# Altium project DC309A.PrjPcb (part 3 of 7)

## Sheet DC309A_PowerSupplies.SchDoc: PowerSupplies
size 558 x 431 mm; Date: Not shown in title block; ApprovedBy: Not shown in title block; CheckedBy: Not shown in title block; Author: Not shown in title block; CompanyName: Not shown in title block; DrawnBy: KAVIKANNAN; Engineer: Not shown in title block; Organization: Not shown in title block; Address1: Not shown in title block; Address2: Not shown in title block; Address3: Not shown in title block; Address4: Not shown in title block; DocumentNumber: 5; Revision: Use project parameter SCH_Rev; SheetNumber: 5; SheetTotal: 11; PageSetup: Record=PageOptions|CenterHorizontal=True|CenterVertical=True|PrintScale=1.00|XCorrection=1.00|YCorrection=1.00|PrintKind=0|BorderSize=5000000|LeftOffset=0|BottomOffset=0|Orientation=2|PaperLength=1000|PaperWidth=1000|Scale=100|PaperSource=15|PrintQuality=600|MediaType=1|DitherType=10|PaperKind=Letter|PrintScaleMode=1; CurrentTime: Not shown in title block; CurrentDate: Not shown in title block; Time: Not shown in title block; DocumentFullPathAndName: Not shown in title block; DocumentName: Not shown in title block; ModifiedDate: Not shown in title block; ImagePath: Not shown in title block
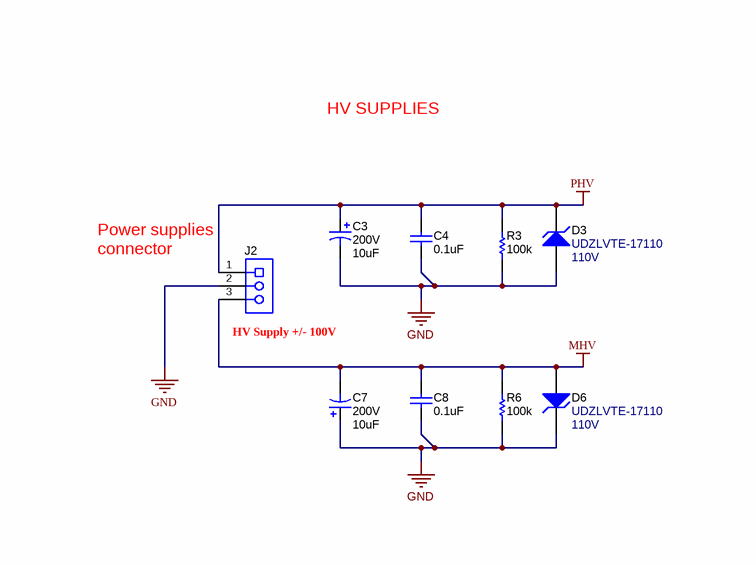
[diagram p12: DC309A_PowerSupplies.SchDoc, top left]
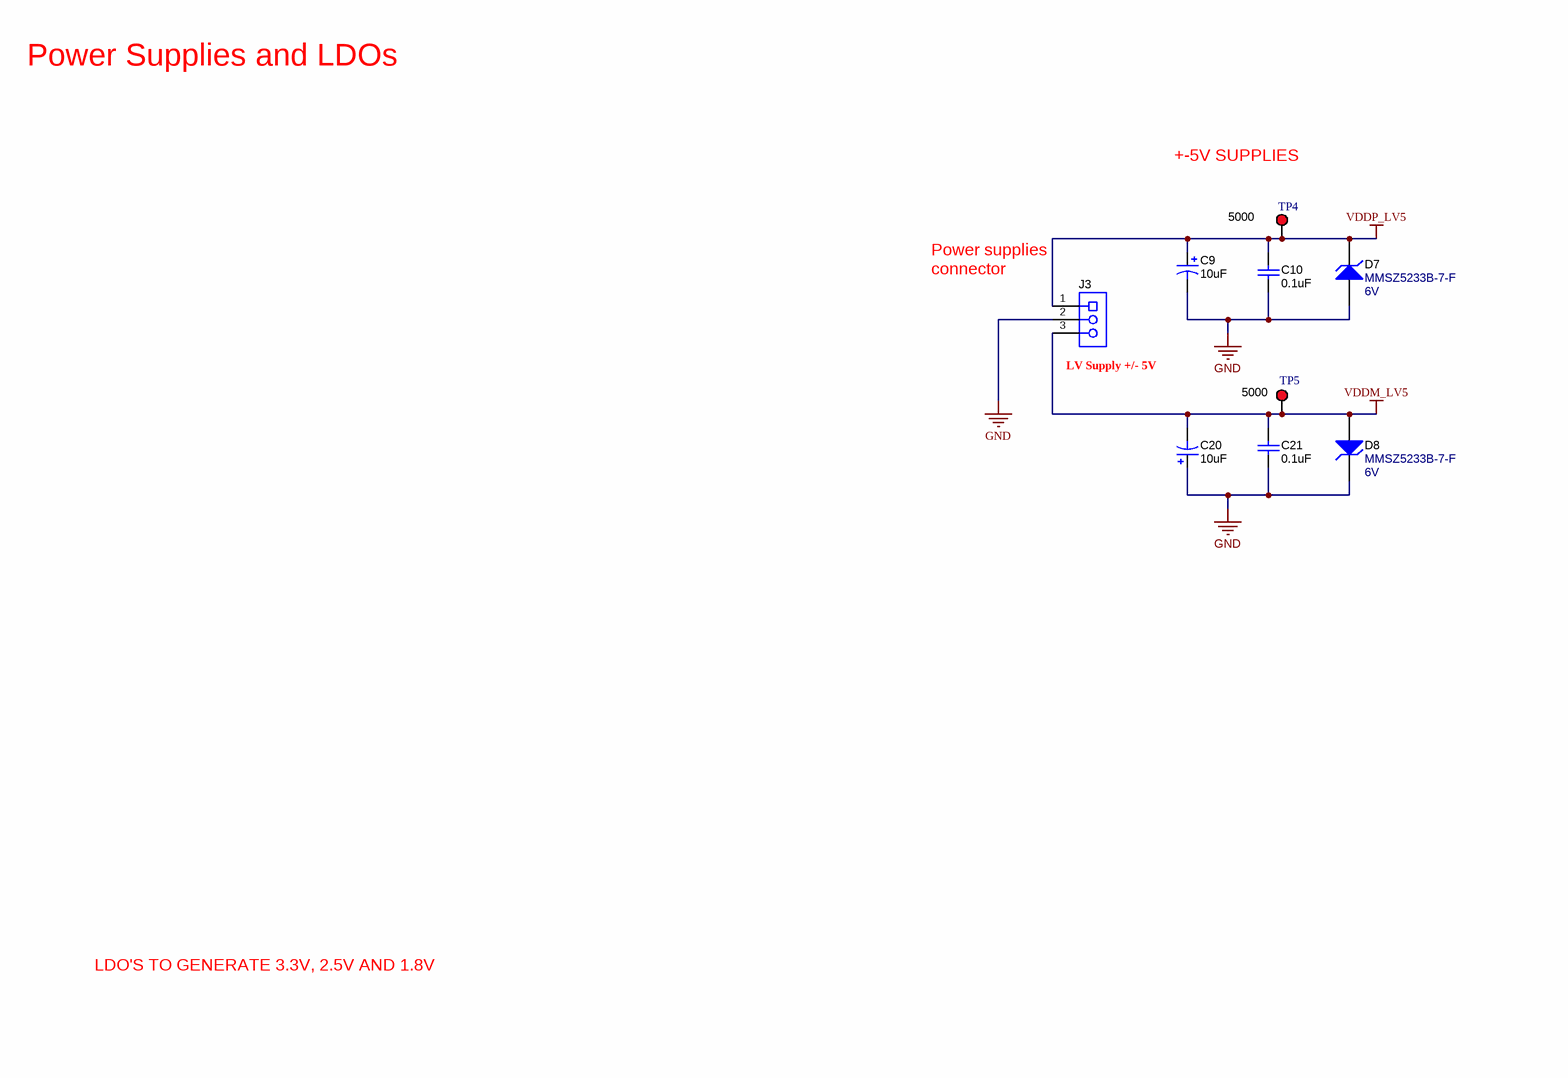
[diagram p13: DC309A_PowerSupplies.SchDoc, top right]
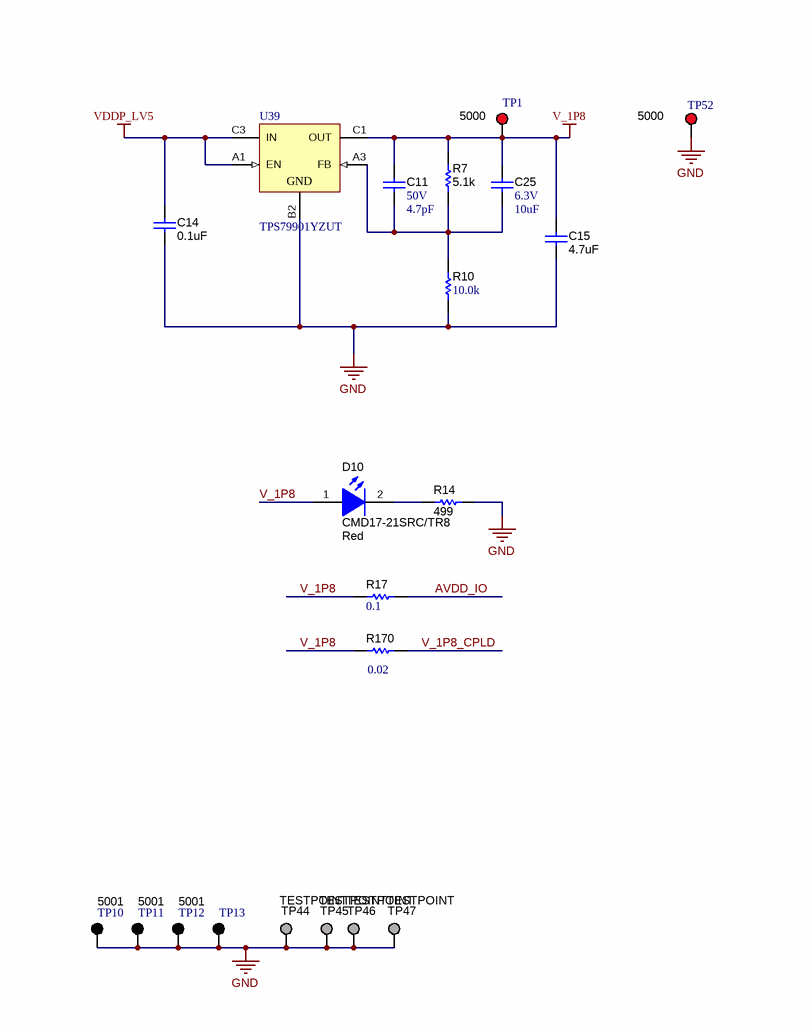
[diagram p14: DC309A_PowerSupplies.SchDoc, bottom left]
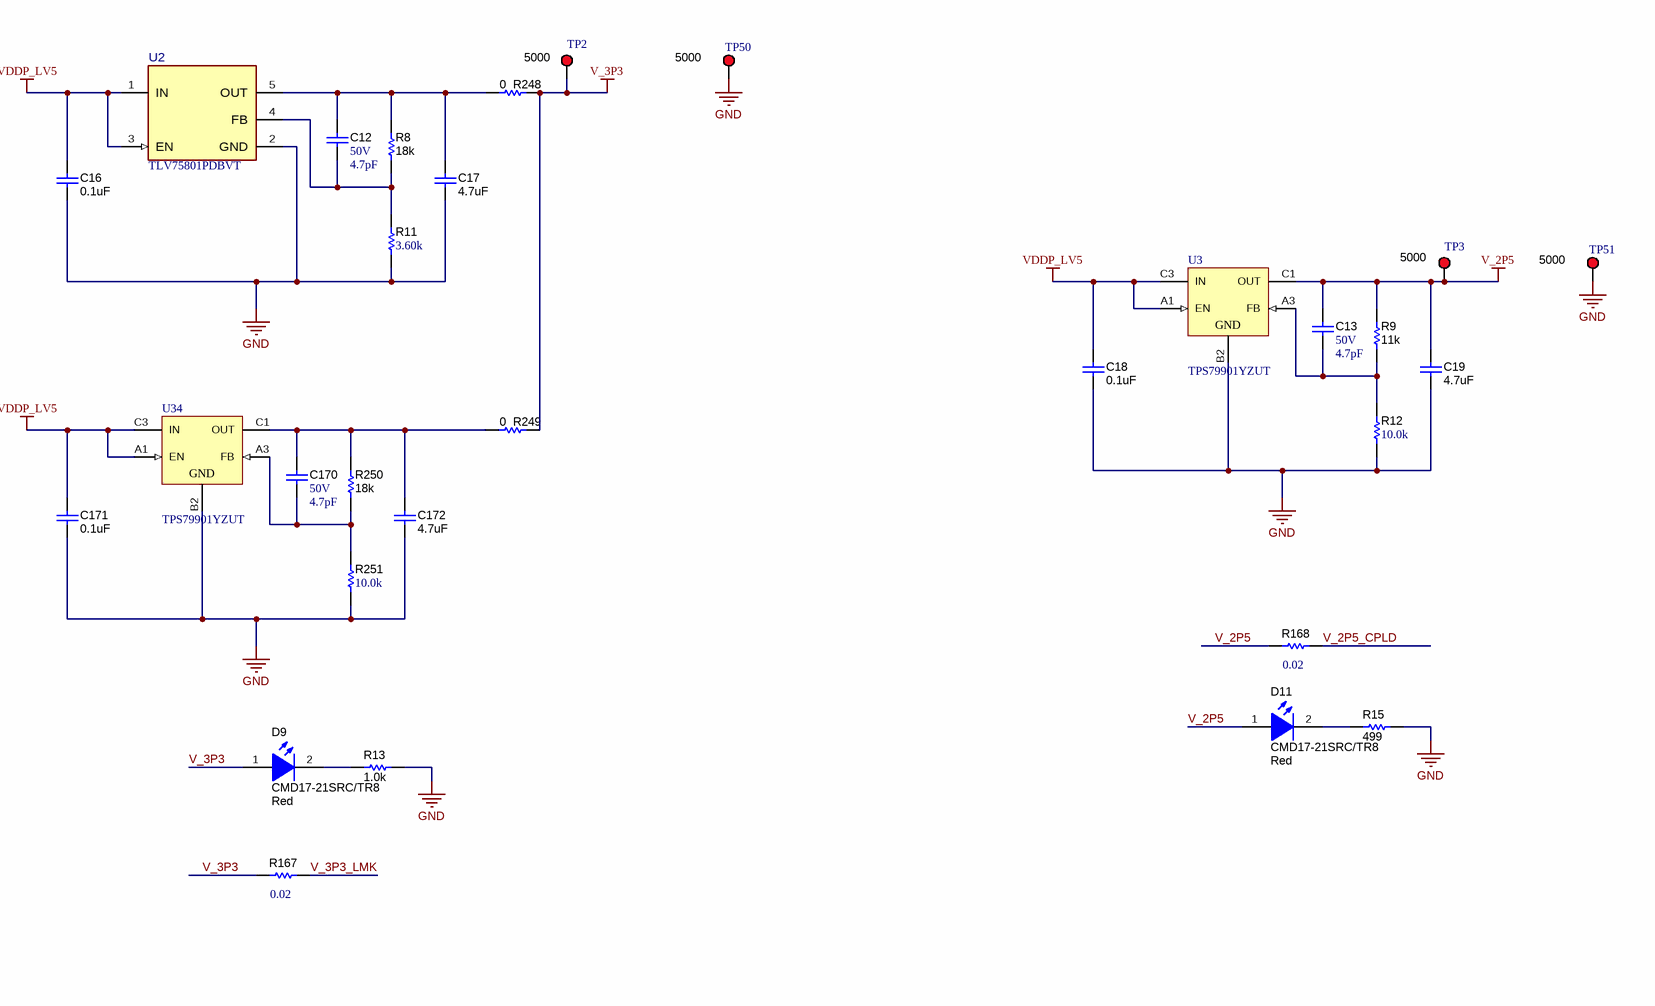
[diagram p15: DC309A_PowerSupplies.SchDoc, bottom right]

### Parts
C3  VDC_V: 200V  ValueDisplayed: 10uF  [CAPPRD350W60D800H1150]  (hidden comment: 200LLE10MEFC8X11.5)
C4  ValueDisplayed: 0.1uF  [1206]  (hidden comment: Capacitor)
C7  VDC_V: 200V  ValueDisplayed: 10uF  [CAPPRD350W60D800H1150]  (hidden comment: 200LLE10MEFC8X11.5)
C8  ValueDisplayed: 0.1uF  [1206]  (hidden comment: Capacitor)
C9  ValueDisplayed: 10uF  [SM_RADIAL_C]  (hidden comment: Cap_Polarized)
C10  ValueDisplayed: 0.1uF  [0402]  (hidden comment: Capacitor)
C11  VDC_V: 50V  ValueDisplayed: 4.7pF  [0603]  (hidden comment: 06035A4R7CAT2A)
C12  VDC_V: 50V  ValueDisplayed: 4.7pF  [0603]  (hidden comment: 06035A4R7CAT2A)
C13  VDC_V: 50V  ValueDisplayed: 4.7pF  [0603]  (hidden comment: 06035A4R7CAT2A)
C14  ValueDisplayed: 0.1uF  [0402]  (hidden comment: Capacitor)
C15  ValueDisplayed: 4.7uF  [0805_HV]  (hidden comment: Capacitor)
C16  ValueDisplayed: 0.1uF  [0402]  (hidden comment: Capacitor)
C17  ValueDisplayed: 4.7uF  [0805_HV]  (hidden comment: Capacitor)
C18  ValueDisplayed: 0.1uF  [0402]  (hidden comment: Capacitor)
C19  ValueDisplayed: 4.7uF  [0805_HV]  (hidden comment: Capacitor)
C20  ValueDisplayed: 10uF  [SM_RADIAL_C]  (hidden comment: Cap_Polarized)
C21  ValueDisplayed: 0.1uF  [0402]  (hidden comment: Capacitor)
C25  VDC_V: 6.3V  ValueDisplayed: 10uF  [0603]  (hidden comment: GRM188R60J106ME47D)
C170  VDC_V: 50V  ValueDisplayed: 4.7pF  [0603]  (hidden comment: 06035A4R7CAT2A)
C171  ValueDisplayed: 0.1uF  [0402]  (hidden comment: Capacitor)
C172  ValueDisplayed: 4.7uF  [0805_HV]  (hidden comment: Capacitor)
D3  UDZLVTE-17110  value 110V  [SOD-323F]
D6  UDZLVTE-17110  value 110V  [SOD-323F]
D7  MMSZ5233B-7-F  value 6V  [SOD-123]
D8  MMSZ5233B-7-F  value 6V  [SOD-123]
D9  CMD17-21SRC/TR8  value Red  [CMD17-21_Red]
D10  CMD17-21SRC/TR8  value Red  [CMD17-21_Red]
D11  CMD17-21SRC/TR8  value Red  [CMD17-21_Red]
J2  1725669  [Phoenix_1725669]  (value not drawn)
J3  1725669  [Phoenix_1725669]  (value not drawn)
R3  ValueDisplayed: 100k  [1206]  (hidden comment: Resistor)
R6  ValueDisplayed: 100k  [1206]  (hidden comment: Resistor)
R7  ValueDisplayed: 5.1k  [0402]  (hidden comment: CMP-0026951-5)
R8  ValueDisplayed: 18k  [0402]  (hidden comment: CRCW040218K0JNED)
R9  ValueDisplayed: 11k  [0402]  (hidden comment: Resistor)
R10  ValueDisplayed: 10.0k  [0402]  (hidden comment: CRCW040210K0DHEDP)
R11  ValueDisplayed: 3.60k  [0603]  (hidden comment: RG1608P-362-B-T5)
R12  ValueDisplayed: 10.0k  [0402]  (hidden comment: CRCW040210K0DHEDP)
R13  ValueDisplayed: 1.0k  [0402]  (hidden comment: Resistor)
R14  ValueDisplayed: 499  [0402]  (hidden comment: Resistor)
R15  ValueDisplayed: 499  [0402]  (hidden comment: Resistor)
R17  ValueDisplayed: 0.1  [0603]  (hidden comment: ERJ-L03KF10CV)
R167  Res_ohm: 0.02  [0603]  (hidden comment: RL0603FR-070R02L)
R168  Res_ohm: 0.02  [0603]  (hidden comment: RL0603FR-070R02L)
R170  Res_ohm: 0.02  [0603]  (hidden comment: RL0603FR-070R02L)
R248  Res_ohm: 0  [0402]  (hidden comment: Resistor)
R249  Res_ohm: 0  [0402]  (hidden comment: Resistor)
R250  ValueDisplayed: 18k  [0402]  (hidden comment: CRCW040218K0JNED)
R251  ValueDisplayed: 10.0k  [0402]  (hidden comment: CRCW040210K0DHEDP)
TP1  5000  [Keystone5000]
TP2  5000  [Keystone5000]
TP3  5000  [Keystone5000]
TP4  5000  [Keystone5000]
TP5  5000  [Keystone5000]
TP10  5001  [Keystone5001]
TP11  5001  [Keystone5001]
TP12  5001  [Keystone5001]
TP13  5001  [Keystone5001]  (value not drawn)
TP44  TESTPOINT  [TP_50MIL-SMT]  (no BOM)
TP45  TESTPOINT  [TP_50MIL-SMT]  (no BOM)
TP46  TESTPOINT  [TP_50MIL-SMT]  (no BOM)
TP47  TESTPOINT  [TP_50MIL-SMT]  (no BOM)
TP50  5000  [Keystone5000]
TP51  5000  [Keystone5000]
TP52  5000  [Keystone5000]
U2  TLV75801PDBVT  [DBV0005A-MFG]
U3  TPS79901YZUT  [YZU0005AEBC]
U34  TPS79901YZUT  [YZU0005AEBC]
U39  TPS79901YZUT  [YZU0005AEBC]

### Nets
AVDD_IO: R17.2
GND: C3.2(-) C4.2 C7.1(+) C8.2 C9.2(-) C10.2 C14.2 C15.1 C16.2 C17.2 C18.2 C19.2 C20.1(+) C21.2 C171.2 C172.2 D3.2(A) D6.1(K) D7.2(A) D8.1(K) J2.2 J3.2 R3.1 R6.1 R10.1 R11.1 R12.1 R13.2 R14.2 R15.2 R251.1 TP10.1 TP11.1 TP12.1 TP13.1 TP44.1 TP45.1 TP46.1 TP47.1 TP50.1 TP51.1 TP52.1 U2.2(GND) U3.B2(GND) U34.B2(GND) U39.B2(GND)
MHV: C7.2(-) C8.1 D6.2(A) J2.3 R6.2
PHV: C3.1(+) C4.1 D3.1(K) J2.1 R3.2
V_1P8: C11.1 C15.2 C25.1 D10.1(A) R7.1 R17.1 R170.1 TP1.1 U39.C1(OUT)
V_2P5: C13.1 C19.1 D11.1(A) R9.2 R168.1 TP3.1 U3.C1(OUT)
V_3P3: D9.1(A) R167.1 R248.2 R249.2 TP2.1
VDDM_LV5: C20.2(-) C21.1 D8.2(A) J3.3 TP5.1
VDDP_LV5: C9.1(+) C10.1 C14.1 C16.1 C18.1 C171.1 D7.1(K) J3.1 TP4.1 U2.1(IN) U2.3(EN) U3.A1(EN) U3.C3(IN) U34.A1(EN) U34.C3(IN) U39.A1(EN) U39.C3(IN)
V_1P8_CPLD: R170.2
V_2P5_CPLD: R168.2
V_3P3_LMK: R167.2
NetC11_2: C11.2 C25.2 R7.2 R10.2 U39.A3(FB)
NetC12_1: C12.1 C17.1 R8.2 R248.1 U2.5(OUT)
NetC12_2: C12.2 R8.1 R11.2 U2.4(FB)
NetC13_2: C13.2 R9.1 R12.2 U3.A3(FB)
NetC170_1: C170.1 C172.1 R249.1 R250.2 U34.C1(OUT)
NetC170_2: C170.2 R250.1 R251.2 U34.A3(FB)
NetD9_2: D9.2(K) R13.1
NetD10_2: D10.2(K) R14.1
NetD11_2: D11.2(K) R15.1

### Notes on the sheet
- Power Supplies and LDOs
- HV SUPPLIES
- +-5V SUPPLIES
- (near J2) Power supplies connector
- (near J3) Power supplies connector
- (near J2) HV Supply +/- 100V
- (near J3) LV Supply +/- 5V
- LDO'S TO GENERATE 3.3V, 2.5V AND 1.8V
- Drawn By:
- SVN Rev:
- Number:
- TID #:
- Orderable:
- Rev:
- Sheet Title:
- File:
- Project Title:
- Designed for:
- Assembly Variant:
- Mod. Date:
- Sheet:
- Size:
- of
- C
- http://www.ti.com
- Texas Instruments and/or its licensors do not warrant the accuracy or completeness of this specification or any information contained therein. Texas Instruments and/or its licensors do not warrant that this design will meet the specifications, will be suitable for your application or fit for any particular purpose, or will operate in an implementation. Texas Instruments and/or its licensors do not warrant that the design is production worthy. You should completely validate and test your design implementation to confirm the system functionality for your application.
- Engineer:
- Contact:
- © Texas Instruments

### Library data of the parts
C3 C7 = CMP-0009946-2: CAP, AL, 10 uF, 200 V, +/- 20%, TH; Manufacturer: Rubycon; TaMin_C: -40°C; Polarized: Y; SizeAreaWB_mm2: 100; Value1: Unknown; U/M: EA; Value: 10uF; TaMax_C: 105°C; SizeZ_mm: 13; SizeX_mm: 8; Cap_Case: Radial 8x11.5mm; SizeArea_mm2: 64; CompType: Capacitor; AEC Qualified: N; Cap_F: 10µF; IRMS_A: 80mA; AEC Category: Q200; Supplier Part Number 2: 43W3997; Publisher: Texas Instruments; Supplier 2: Newark; RoHS: Y; MountType: TH; Supplier 1: Digi-Key; PackageReference: RCAP_8x11.5mm; Tolerance_%: 20%; SizeY_mm: 8; Value2: 200V; LatestRevisionDate: 2017-03-09; PartNumber: 200LLE10MEFC8X11.5; Series: LLE; ComponentLink1Description: Datasheet link; AEC Grade: N/A; Supplier Part Number 1: 1189-1175-ND; Technology: AL; ComponentLink1URL: http://www.rubycon.co.jp/en/catalog/e_pdfs/aluminum/e_lle.pdf
C4 C8 = CMP-0008585-2: CAP, CERM, 0.1 uF, 200 V, +/- 10%, X7R, 1206; PartNumber: C1206C104K2RACTU; Manufacturer: Kemet; Polarized: N; Value: 0.1uF; U/M: EA; Cap_F: 100nF; Value1: Unknown; VDC_V: 200V; TaMin_C: -55°C; TaMax_C: 125°C; SizeArea_mm2: 5.12; SizeAreaWB_mm2: 10.92; SizeX_mm: 3.2; SizeY_mm: 1.6; SizeZ_mm: 1.35; AEC Category: Q200; CompType: Capacitor; PackageReference: 1206; RoHS: Y; Tolerance_%: 10%; Value2: 200V; MountType: SMT; Technology: Ceramic; TempCo: X7R; Cap_Case: 1206; Published: 2008-06-19; Publisher: Texas Instruments; LatestRevisionDate: 2017-03-09; ComponentLink1Description: Datasheet link; ComponentLink1URL: http://www.kemet.com/docfinder?Partnumber=C1206C104K2RACTU; Supplier 1: Digi-Key; Supplier Part Number 1: 399-8139-1-ND; Supplier 2: Newark; Supplier Part Number 2: 36X2787; Supplier 3: Mouser; Supplier Part Number 3: 80-C1206C104K2R; AEC Qualified: N; AEC Grade: N/A
C9 C20 = CMP-0010721-1: CAP, AL, 10 uF, 35 V, +/- 20%, 0.7 ohm, AEC-Q200 Grade 2, SMD; PartNumber: EEE-FK1V100R; Manufacturer: Panasonic; Polarized: Y; CompType: Capacitor; Value: 10uF; U/M: EA; Cap_F: 10µF; Value1: 0.7 ohm; VDC_V: 35V; ESR_ohm: 7d; IRMS_A: 1.6dA; TaMin_C: -55°C; TaMax_C: 105°C; Cap_Case: C; SizeAreaWB_mm2: 62.05; SizeArea_mm2: 34.45; SizeX_mm: 6.5; SizeY_mm: 5.3; SizeZ_mm: 5.4; AEC Category: Q200; AEC Grade: 2; PackageReference: SMT Radial C; RoHS: Y; Tolerance_%: 20%; Value2: 35V; MountType: SMT; Technology: AL; Series: FK; Publisher: Texas Instruments; LatestRevisionDate: 2017-03-09; ComponentLink1Description: Datasheet link; ComponentLink1URL: https://industrial.panasonic.com/cdbs/www-data/pdf/RDE0000/ABA0000C1181.pdf; Supplier 1: Digi-Key; Supplier Part Number 1: PCE3833CT-ND; Supplier 2: Mouser; Supplier Part Number 2: 667-EEE-FK1V100R; Supplier 3: Farnell; Supplier Part Number 3: 1850112; AEC Qualified: Y
C10 C14 C16 C18 C21 C171 = CMP-0006201-2: CAP, CERM, 0.1 uF, 16 V, +/- 10%, X7R, 0402; PartNumber: 0402YC104KAT2A; Manufacturer: AVX; Polarized: N; Value: 0.1uF; U/M: EA; Cap_F: 100nF; Value1: Unknown; VDC_V: 16V; TaMin_C: -55°C; TaMax_C: 125°C; SizeArea_mm2: 0.5; SizeAreaWB_mm2: 3; SizeX_mm: 1; SizeZ_mm: 0.6; AEC Category: Q200; CompType: Capacitor; PackageReference: 0402; RoHS: Y; Tolerance_%: 10%; Value2: 16V; MountType: SMT; Technology: Ceramic; TempCo: X7R; Cap_Case: 0402; SizeY_mm: 0.5; Published: 2008-06-19; Publisher: Texas Instruments; LatestRevisionDate: 2017-03-09; ComponentLink1Description: Datasheet link; ComponentLink1URL: http://catalogs.avx.com/SurfaceMount.pdf; Supplier 1: Digi-Key; Supplier Part Number 1: 478-7888-1-ND; Supplier 2: Newark; Supplier Part Number 2: 09R7024; Supplier 3: Mouser; Supplier Part Number 3: 581-0402YC104KAT2A; AEC Qualified: N; AEC Grade: N/A
C11-C13 C170 = CMP-0006791-4: CAP, CERM, 4.7 pF, 50 V, +/- 5%, C0G/NP0, 0603; Manufacturer: AVX; TaMin_C: -55°C; ESR_ohm: 0.633; Polarized: N; SizeAreaWB_mm2: 4.68; Value1: 0.633 ohm; U/M: EA; Value: 4.7pF; TaMax_C: 125°C; SizeZ_mm: 1; SizeX_mm: 1.6; SizeY_mm: 0.8; SizeArea_mm2: 1.28; AEC Category: Q200; Supplier Part Number 2: 581-06035A4R7C; Publisher: Texas Instruments; Supplier 2: Mouser; Supplier Part Number 3: 1833866; TempCo: C0G/NP0; Supplier 3: Farnell; Published: 2008-06-19; RoHS: Y; MountType: SMT; Supplier 1: Digi-Key; PackageReference: 0603; Tolerance_%: 5%; Cap_Case: 0603; Value2: 50V; CompType: Capacitor; LatestRevisionDate: 2017-03-09; PartNumber: 06035A4R7CAT2A; AEC Qualified: N; Cap_F: 4.7pF; ComponentLink1Description: Datasheet link; AEC Grade: N/A; Supplier Part Number 1: 478-1159-1-ND; Technology: Ceramic; ComponentLink1URL: http://datasheets.avx.com/C0GNP0-Dielectric.pdf
C15 C17 C19 C172 = CMP-0007800-2: CAP, CERM, 4.7 uF, 25 V, +/- 10%, X5R, 0805; PartNumber: C0805C475K3PACTU; Manufacturer: Kemet; Polarized: N; Value: 4.7uF; U/M: EA; Cap_F: 4.7µF; Value1: Unknown; VDC_V: 25V; TaMin_C: -55°C; TaMax_C: 85°C; Cap_Case: 0805; SizeArea_mm2: 2.5; SizeAreaWB_mm2: 6.75; SizeX_mm: 2; SizeY_mm: 1.25; SizeZ_mm: 1.45; AEC Category: Q200; CompType: Capacitor; PackageReference: 0805; RoHS: Y; Tolerance_%: 10%; Value2: 25V; MountType: SMT; Technology: Ceramic; TempCo: X5R; Published: 2008-06-19; Publisher: Texas Instruments; LatestRevisionDate: 2017-03-09; ComponentLink1Description: Datasheet link; ComponentLink1URL: http://www.kemet.com/docfinder?Partnumber=C0805C475K3PACTU; Supplier 1: Digi-Key; Supplier Part Number 1: 399-5505-1-ND; Supplier 2: Newark; Supplier Part Number 2: 01N5605; Supplier 3: Mouser; Supplier Part Number 3: 80-C0805C475K3P; AEC Qualified: N; AEC Grade: N/A
C25 = CMP-0007303-5: CAP, CERM, 10 uF, 6.3 V, +/- 20%, X5R, 0603; Manufacturer: MuRata; TaMin_C: -55°C; ESR_ohm: 9m; Polarized: N; SizeAreaWB_mm2: 4.68; Value1: 0.009 ohm; U/M: EA; Value: 10uF; TaMax_C: 125°C; SizeZ_mm: 1; SizeX_mm: 1.6; SizeY_mm: 0.8; SizeArea_mm2: 1.28; Cap_F: 10µF; IRMS_A: 2.74A; AEC Category: Q200; Supplier Part Number 2: 81-GRM188R60J106ME47; Publisher: Texas Instruments; Supplier 2: Mouser; Supplier Part Number 3: 1735528; TempCo: X5R; Supplier 3: Farnell; Published: 2008-06-19; RoHS: Y; MountType: SMT; Supplier 1: Digi-Key; PackageReference: 0603; Tolerance_%: 20%; Cap_Case: 0603; Value2: 6.3V; CompType: Capacitor; LatestRevisionDate: 2017-03-09; PartNumber: GRM188R60J106ME47D; AEC Qualified: ?; ComponentLink1Description: Datasheet link; Supplier Part Number 1: 490-3896-1-ND; Technology: Ceramic; ComponentLink1URL: http://www.murata.com/products/capacitor/tech_data/pdf/grm188r60j106m.pdf
D3 D6 = CMP-0082118-3: Diode, Zener, 110 V, 200 mW, SOD-323F; Manufacturer: Rohm; SizeAreaWB_mm2: 7.875; SizeArea_mm2: 3.125; AEC Qualified: N; AEC Category: Q101; SizeZ_mm: 0.8; Power_W: 200mW; SizeY_mm: 1.25; Value1: 0.2W; SizeX_mm: 2.5; ComponentLink1Description: Datasheet link; RoHS: Y; PackageReference: SOD-323F; PartNumber: UDZLVTE-17110; Vz_V: 110V; ComponentLink1URL: http://rohmfs.rohm.com/en/products/databook/datasheet/discrete/diode/zener/udzlvte-17110-e.pdf; CompType: Zener; MountType: SMT
D7 D8 = CMP-0005804-3: Diode, Zener, 6 V, 500 mW, SOD-123; Manufacturer: Diodes Inc.; Power_W: 500mW; SizeAreaWB_mm2: 13.095; Value1: 0.5W; RJA_CperW: 350; SizeZ_mm: 1.35; SizeX_mm: 3.85; SizeY_mm: 1.7; SizeArea_mm2: 6.545; AEC Category: Q101; ComponentLink1URL: http://www.diodes.com/datasheets/ds18010.pdf; Vz_V: 6V; RoHS: Y; MountType: SMT; PackageReference: SOD-123; CompType: Zener; PartNumber: MMSZ5233B-7-F; AEC Qualified: ?; ComponentLink1Description: Datasheet link
D9-D11 = CMP-0084855-1: LED, Red, SMD; Manufacturer: Visual Communications Company, LLC; SizeX_mm: 2; SizeArea_mm2: 2.5; SizeAreaWB_mm2: 6.75; Angle: 140; Value2: 1.7V; Ir_A: 100µA; Value1: 0.1W; SizeY_mm: 1.25; Io_A: 20mA; Tjmax_C: 85°C; Power_TotalModule: 100mW; SizeZ_mm: 1.2; Vr_V: 5V; ComponentLink1URL: https://vcclite.com/wp-content/uploads/wpallimport/files/files/CMD1721Seriesver3.pdf; ComponentLink1Description: Datasheet link; PackageReference: 2x1.25mm; Color: Red; PartNumber: CMD17-21SRC/TR8; Vf_V: 1.7V; RoHS: Y; MountType: SMT; Type: ?; CompType: LED
J2 J3 = CMP-0055500-1: Terminal Block, 3x1, 2.54 mm, TH; Manufacturer: Phoenix Contact; CNHeader: FALSE; Green_Lifecycle: Not Set; Green_REACh: Incomplete; CT: TRUE; ComponentLink1URL: https://www.phoenixcontact.com/online/portal/us?uri=pxc-oc-itemdetail:pid=1725669&library=usen&tab=1; Supplier Part Number 2: 71C4108; Publisher: Texas Instruments; Supplier 2: Newark; Supplier Part Number 3: 651-1725669; Supplier 3: Mouser; RoHS: Y; MountType: TH; Green_EU RoHS-2: Incomplete; Supplier 1: Digi-Key; Green_EU RoHS: Incomplete; PackageReference: Terminal Block, 3x1, 2.54 mm, TH; CompType: Terminal Block; LatestRevisionDate: 26/05/2017; PartNumber: 1725669; ComponentLink1Description: Datasheet URL; Supplier Part Number 1: 277-1274-ND
R3 R6 = CMP-0018819-2: RES, 100 k, 0.1%, 0.25 W, AEC-Q200 Grade 1, 1206; PartNumber: TNPW1206100KBEEA; Manufacturer: Vishay-Dale; Value: 100k; Power_W: 250mW; Value2: 0.25W; VDC_V: 200V; TempCo: 25 ppm/C; SizeArea_mm2: 5.12; SizeX_mm: 3.2; SizeY_mm: 1.6; SizeZ_mm: 1.35; EIA_Code: E192; U/M: EA; AEC Category: Q200; AEC Qualified: Y; AEC Grade: 1; CompType: Resistor; PackageReference: 1206; RoHS: Y; Res_ohm: 100k; Value_Code: 100k; Tolerance_%: 0.1%; Value1: 0.1%; MountType: SMT; Technology: Thin Film; Published: 2008-06-26; Publisher: Texas Instruments; LatestRevisionDate: 2017-03-09; ComponentLink1Description: Datasheet link; ComponentLink1URL: http://www.vishay.com/docs/28758/tnpw_e3.pdf; Supplier 1: Digi-Key; Supplier Part Number 1: TNP100KACCT-ND; Supplier 2: Newark; Supplier Part Number 2: 27K5908; Supplier 3: Mouser; Supplier Part Number 3: 71-TNPW1206100KBEEA
R7 = CMP-0026951-5: RES, 5.1 k, 5%, 0.063 W, AEC-Q200 Grade 0, 0402; PartNumber: CRCW04025K10JNED; Manufacturer: Vishay-Dale; Value: 5.1k; Value_Code: 5k10; Power_W: 63mW; Value2: 0.063W; VDC_V: 50V; TempCo: 200 ppm/C; SizeArea_mm2: 0.5; SizeX_mm: 1; SizeZ_mm: 0.6; EIA_Code: E24; AEC Category: Q200; AEC Qualified: Y; AEC Grade: 0; CompType: Resistor; PackageReference: 0402; RoHS: E; Res_ohm: 5.1k; Tolerance_%: 5%; Value1: 5%; MountType: SMT; Technology: Thick Film; SizeY_mm: 0.5; ComponentLink1Description: Datasheet link; ComponentLink1URL: http://www.vishay.com/docs/20035/dcrcwe3.pdf; Supplier 1: Digi-Key; Supplier Part Number 1: 541-5.1KJCT-ND; Supplier 2: Newark; Supplier Part Number 2: 72M6798; Supplier 3: Mouser; Supplier Part Number 3: 71-CRCW0402J-5.1K-E3
R8 R250 = CMP-0026850-3: RES, 18 k, 5%, 0.063 W, AEC-Q200 Grade 0, 0402; Manufacturer: Vishay-Dale; Power_W: 63mW; TempCo: 200 ppm/C; Value_Code: 18k0; Value: 18k; EIA_Code: E24; SizeX_mm: 1; SizeY_mm: 0.5; SizeZ_mm: 0.6; Value2: 0.063W; CompType: Resistor; AEC Qualified: Y; VDC_V: 50V; AEC Category: Q200; AEC Grade: 0; Supplier Part Number 2: 59M6707; Supplier 2: Newark; Supplier Part Number 3: 71-CRCW0402J-18K-E3; Supplier 3: Mouser; RoHS: E; Value1: 5%; MountType: SMT; Supplier 1: Digi-Key; PackageReference: 0402; Tolerance_%: 5%; Res_ohm: 18k; SizeArea_mm2: 0.5; PartNumber: CRCW040218K0JNED; ComponentLink1Description: Datasheet link; Supplier Part Number 1: 541-18KJCT-ND; Technology: Thick Film; ComponentLink1URL: http://www.vishay.com/docs/20035/dcrcwe3.pdf
R9 = CMP-0026830-3: RES, 11 k, 5%, 0.063 W, AEC-Q200 Grade 0, 0402; PartNumber: CRCW040211K0JNED; Manufacturer: Vishay-Dale; Value: 11k; Value_Code: 11k0; Power_W: 63mW; Value2: 0.063W; VDC_V: 50V; TempCo: 200 ppm/C; SizeArea_mm2: 0.5; SizeX_mm: 1; SizeZ_mm: 0.6; EIA_Code: E24; AEC Category: Q200; AEC Qualified: Y; AEC Grade: 0; CompType: Resistor; PackageReference: 0402; RoHS: E; Res_ohm: 11k; Tolerance_%: 5%; Value1: 5%; MountType: SMT; Technology: Thick Film; SizeY_mm: 0.5; ComponentLink1Description: Datasheet link; ComponentLink1URL: http://www.vishay.com/docs/20035/dcrcwe3.pdf; Supplier 1: Digi-Key; Supplier Part Number 1: 541-11KJCT-ND
R10 R12 R251 = CMP-0026769-2: RES, 10.0 k, 0.5%, 0.063 W, AEC-Q200 Grade 0, 0402; Manufacturer: Vishay-Dale; Power_W: 63mW; TempCo: 50 ppm/C; Value_Code: 10k0; Value: 10.0k; EIA_Code: E192; Res_ohm: 10k; SizeX_mm: 1; SizeY_mm: 0.5; SizeZ_mm: 0.6; Value2: 0.063W; AEC Qualified: Y; VDC_V: 50V; AEC Category: Q200; AEC Grade: 0; ComponentLink1URL: http://www.vishay.com/docs/20036/dcrcwpe3.pdf; Supplier Part Number 2: 51X8307; Supplier 2: Newark; Supplier Part Number 3: 71-CRCW040210K0DHEDP; Supplier 3: Mouser; RoHS: E; Value1: 0.5%; MountType: SMT; Supplier 1: Digi-Key; PackageReference: 0402; Tolerance_%: 0.5%; SizeArea_mm2: 0.5; CompType: Resistor; PartNumber: CRCW040210K0DHEDP; ComponentLink1Description: Datasheet link; Supplier Part Number 1: 541-10KAVCT-ND; Technology: Thick Film
R11 = CMP-0023528-3: RES, 3.60 k, 0.1%, 0.1 W, 0603; Manufacturer: Susumu Co Ltd; Power_W: 100mW; TempCo: 25 ppm/C; Value_Code: 3k60; U/M: EA; Value: 3.60k; Res_ohm: 3.6k; SizeX_mm: 1.6; SizeY_mm: 0.8; SizeZ_mm: 1; Value2: 0.1W; SizeArea_mm2: 1.28; VDC_V: 75V; AEC Category: Q200; ComponentLink1URL: http://www.susumu.co.jp/english/pdf/products-j01-01.pdf; Supplier Part Number 2: 754-RG1608P-362-BT5; Publisher: Texas Instruments; Supplier 2: Mouser; Published: 2008-06-26; RoHS: Y; Value1: 0.1%; MountType: SMT; Supplier 1: Digi-Key; PackageReference: 0603; Tolerance_%: 0.1%; CompType: Resistor; LatestRevisionDate: 2017-03-09; PartNumber: RG1608P-362-B-T5; AEC Qualified: ?; ComponentLink1Description: Datasheet link; Supplier Part Number 1: RG16P3.6KBCT-ND; Technology: Metal Film
R13 = CMP-0026852-3: RES, 1.0 k, 5%, 0.063 W, AEC-Q200 Grade 0, 0402; PartNumber: CRCW04021K00JNED; Manufacturer: Vishay-Dale; Value: 1.0k; Res_ohm: 1k; Value_Code: 1k00; Power_W: 63mW; Value2: 0.063W; VDC_V: 50V; TempCo: 200 ppm/C; SizeArea_mm2: 0.5; SizeX_mm: 1; SizeZ_mm: 0.6; EIA_Code: E24; AEC Category: Q200; AEC Qualified: Y; AEC Grade: 0; CompType: Resistor; PackageReference: 0402; RoHS: E; Tolerance_%: 5%; Value1: 5%; MountType: SMT; Technology: Thick Film; SizeY_mm: 0.5; ComponentLink1Description: Datasheet link; ComponentLink1URL: http://www.vishay.com/docs/20035/dcrcwe3.pdf; Supplier 1: Digi-Key; Supplier Part Number 1: 541-1.0KJCT-ND; Supplier 2: Newark; Supplier Part Number 2: 59M6691; Supplier 3: Mouser; Supplier Part Number 3: 71-CRCW0402J-1.0K-E3
R14 R15 = CMP-0026402-2: RES, 499, 1%, 0.063 W, AEC-Q200 Grade 0, 0402; PartNumber: CRCW0402499RFKED; Manufacturer: Vishay-Dale; Value: 499; Value_Code: 499R; Power_W: 63mW; Value2: 0.063W; VDC_V: 50V; TempCo: 100 ppm/C; SizeArea_mm2: 0.5; SizeX_mm: 1; SizeZ_mm: 0.6; EIA_Code: E96; AEC Category: Q200; AEC Qualified: Y; AEC Grade: 0; CompType: Resistor; PackageReference: 0402; RoHS: E; Res_ohm: 499; Tolerance_%: 1%; Value1: 1%; MountType: SMT; Technology: Thick Film; SizeY_mm: 0.5; ComponentLink1Description: Datasheet link; ComponentLink1URL: http://www.vishay.com/docs/20035/dcrcwe3.pdf; Supplier 1: Digi-Key; Supplier Part Number 1: 541-499LCT-ND; Supplier 2: Newark; Supplier Part Number 2: 52K7117; Supplier 3: Mouser; Supplier Part Number 3: 71-CRCW0402-499-E3
R17 = CMP-0022725-3: RES, 0.1, 1%, 0.1 W, AEC-Q200 Grade 1, 0603; Manufacturer: Panasonic; Power_W: 100mW; TempCo: 200 ppm/C; Value_Code: R100; Value: 0.1; EIA_Code: E96; SizeX_mm: 1.6; SizeY_mm: 0.8; SizeZ_mm: 1; Value2: 0.1W; SizeArea_mm2: 1.28; AEC Qualified: Y; AEC Category: Q200; SizeAreaWB_mm2: 4.68; ComponentLink1URL: https://industrial.panasonic.com/cdbs/www-data/pdf/RDN0000/AOA0000C313.pdf; Supplier Part Number 2: 667-ERJ-L03KF10CV; Supplier 2: Mouser; Supplier Part Number 3: 1577550; Supplier 3: Farnell; RoHS: Y; Value1: 1%; MountType: SMT; Supplier 1: Digi-Key; PackageReference: 0603; Tolerance_%: 1%; Res_ohm: 0.1; CompType: Resistor; PartNumber: ERJ-L03KF10CV; ComponentLink1Description: Datasheet link; Supplier Part Number 1: P100LJCT-ND; Technology: Thick Film; AEC Grade: 1
R167 R168 R170 = CMP-0023339-3: RES, 0.02, 1%, 0.1 W, AEC-Q200 Grade 0, 0603; Manufacturer: Yageo America; Power_W: 100mW; TempCo: 1500 ppm/C; Value_Code: R020; U/M: EA; Value: 0.02; EIA_Code: E96; SizeX_mm: 1.6; SizeY_mm: 0.8; SizeZ_mm: 1; Value2: 0.1W; SizeArea_mm2: 1.28; AEC Qualified: Y; AEC Grade: 0; AEC Category: Q200; Supplier Part Number 2: 603-RL0603FR-070R02L; Publisher: Texas Instruments; Supplier 2: Mouser; Published: 2008-06-26; RoHS: Y; Value1: 1%; MountType: SMT; Supplier 1: Digi-Key; PackageReference: 0603; Tolerance_%: 1%; CompType: Resistor; LatestRevisionDate: 2017-03-09; PartNumber: RL0603FR-070R02L; ComponentLink1Description: Datasheet link; Supplier Part Number 1: 311-.02QCT-ND; Technology: Thick Film; ComponentLink1URL: http://www.yageo.com/documents/recent/PYu-RL_Group_521_RoHS_L_1.pdf
R248 R249 = CMP-0026992-3: RES, 0, 5%, 0.1 W, AEC-Q200 Grade 0, 0402; PartNumber: ERJ-2GE0R00X; Manufacturer: Panasonic; Value_Code: 0000; Power_W: 100mW; Value2: 0.1W; VDC_V: 50V; TempCo: 600 ppm/C; SizeArea_mm2: 0.5; SizeX_mm: 1; SizeZ_mm: 0.6; EIA_Code: E24; AEC Category: Q200; AEC Qualified: Y; SizeAreaWB_mm2: 3; CompType: Resistor; PackageReference: 0402; RoHS: Y; Tolerance_%: 5%; Value1: 5%; MountType: SMT; Technology: Thick Film; SizeY_mm: 0.5; ComponentLink1Description: Datasheet link; ComponentLink1URL: https://industrial.panasonic.com/cdbs/www-data/pdf/RDA0000/AOA0000C301.pdf; Supplier 1: Digi-Key; Supplier Part Number 1: P0.0JCT-ND; Supplier 2: Newark; Supplier Part Number 2: 65T8307; Supplier 3: Mouser; Supplier Part Number 3: 667-ERJ-2GE0R00X; AEC Grade: 0; ValueDisplayed: 0
TP1-TP5 TP50-TP52 = CMP-0055137-2: Test Point, Miniature, Red, TH; Manufacturer: Keystone Electronics; ContactFinish: Silver; CNHeader: FALSE; CT: TRUE; Green_Lifecycle: Active; Green_REACh: Passed; PartNumber: 5000; PackageReference: Red Miniature Testpoint; CompType: Test Point; RoHS: Y; MountType: TH; ComponentLink1Description: Datasheet URL; ComponentLink1URL: http://www.keyelco.com/userAssets/file/M60-2p60.pdf; Color: Red; Publisher: Texas Instruments; LatestRevisionDate: 26/05/2017; Supplier 1: Digi-Key; Supplier Part Number 1: 36-5000-ND; Supplier 2: Mouser; Supplier Part Number 2: 534-5000; Green_EU RoHS-2: Incomplete; Green_EU RoHS: Passed
TP10-TP13 = CMP-0055138-2: Test Point, Miniature, Black, TH; Manufacturer: Keystone Electronics; ContactFinish: Silver; CNHeader: FALSE; CT: TRUE; Green_Lifecycle: Active; Green_REACh: Passed; PartNumber: 5001; PackageReference: Black Miniature Testpoint; CompType: Test Point; RoHS: Y; MountType: TH; ComponentLink1Description: Datasheet URL; ComponentLink1URL: http://www.keyelco.com/userAssets/file/M60-2p60.pdf; Color: Black; Publisher: Texas Instruments; LatestRevisionDate: 26/05/2017; Supplier 1: Digi-Key; Supplier Part Number 1: 36-5001-ND; Supplier 2: Mouser; Supplier Part Number 2: 534-5001; Green_EU RoHS-2: Incomplete; Green_EU RoHS: Passed
TP44-TP47 = CMP-0078143-3: TEST POINT.  No entry in BOM.; PackageReference: N/A; CompType: Testpoint; Manufacturer: N/A; PartNumber: N/A; Library Reference: TESTPOINT
U2 = CMP-0090914-1: Linear Voltage Regulator IC  1 Output  500mA SOT-23-5; Manufacturer: Texas Instruments; Output Type: AdjustableProgrammable; Number Of Outputs: 1; Standoff Height: 0mm; TJmax_C: +125°C; Accuracy Percentage: 0.7%; SizeZ_mm: 1.45mm; AEC Qualified: No; Dropout Voltage: 720mV; Max Supply Voltage: 6V; Min Supply Voltage: 1.5V; Output Voltage: 0.55-5.5V; Nominal Supply Current: 25uA; datasheet: https://www.ti.com/lit/ds/symlink/tlv758p.pdf?ts=1600350480869&ref_url=https%253A%252F%252Fwww.ti.com%252Fproduct%252FTLV758P%253FkeyMatch%253DTLV75801PDBVT%2526tisearch%253DSearch-EN-everything%2526usecase%253DOPN; Part Number: TLV75801PDBVT; PackageReference: SOT-23-5; ComponentLink1URL: https://www.ti.com/lit/ds/symlink/tlv758p.pdf?ts=1600350480869&ref_url=https%253A%252F%252Fwww.ti.com%252Fproduct%252FTLV758P%253FkeyMatch%253DTLV75801PDBVT%2526tisearch%253DSearch-EN-everything%2526usecase%253DOPN; PartNumber: TLV75801PDBVT; Digikey Part Number: 296-TLV75801PDBVTCT-ND; Datasheet Path: datasheets/IC-TLV75801PDBVT.pdf; Lead Free: Yes; Mouser Part Number: 595-TLV75801PDBVT; Operating Temperature Range: -40°C to +125°C; Digikey Description: VOLTAGE COMPARATOR; helpURL: https://upverter.com/upn/revision/a517b52052e7a36b/; ComponentLink1Description: Datasheet; RoHS: TRUE
U3 U34 U39 = CMP-0394-01635-2: Single Output High PSRR LDO, 200 mA, Adjustable 1.2 to 6.5 V Output, 2.7 to 6.5 V Input, with Low IQ, 5-pin DSBGA (YZU), -40 to 85 degC, Green (RoHS & no Sb/Br); Manufacturer: Texas Instruments; Vdo(Typ)(mV): 90; Vin(Min)(V): 2.7; Iq(Typ)(mA): 0.04; Vout Adj(Max)(V): 6.5; Accuracy(%): 2; Vout Adj(Min)(V): 1.2; Iout(Max)(A): 0.2; SubFamily: Single Channel LDO; Rating: Catalog; Eco-Plan: Green (RoHS & no Sb/Br); ComponentLink4Description: URL Link1; DatasheetVersion: SBVS056J; ComponentLink3URL: http://www.ti.com/litv/pdf/mpds018i; PackageReference: YZU0005AEBC; PackageVersion: 4205678/D; Vin(Max)(V): 6.5; PackageDescription: 5-Pin Silicon Grid Array, Body 1.337 x 0.971 mm, Pitch 0.25 mm; PartNumber: TPS79901YZUT; ComponentLink2Description: Datasheet; ComponentLink3Description: Package Specification; ComponentLink4URL: Samples URL:http://www.ti.com/product/tps79901#samples; Mounting Technology: Surface Mount; ComponentLink2URL: http://www.ti.com/general/docs/lit/getliterature.tsp?genericPartNumber=TPS79901&fileType=pdf; ComponentLink1URL: http://www.ti.com/; ComponentLink1Description: Manufacturer URL